# Altium schematic sheet keyboard.SchDoc
size A1
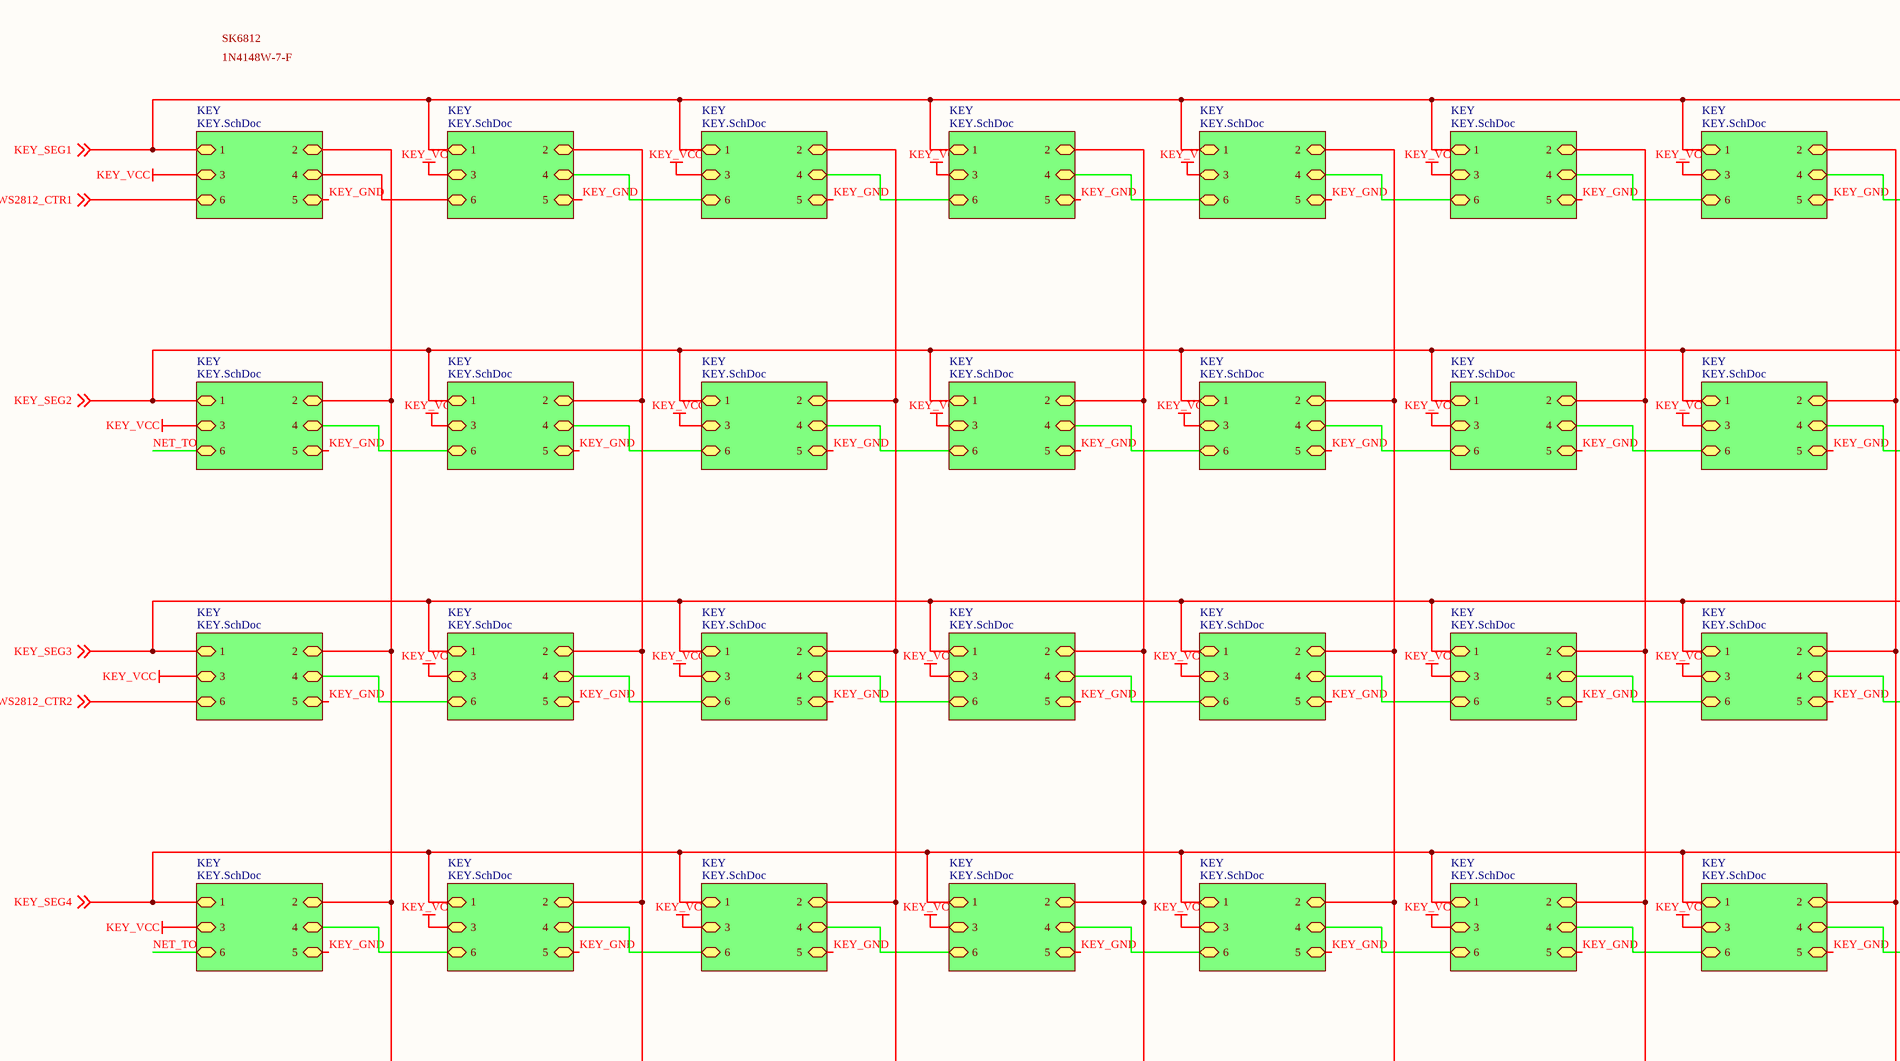
[diagram p0: keyboard.SchDoc, top left]
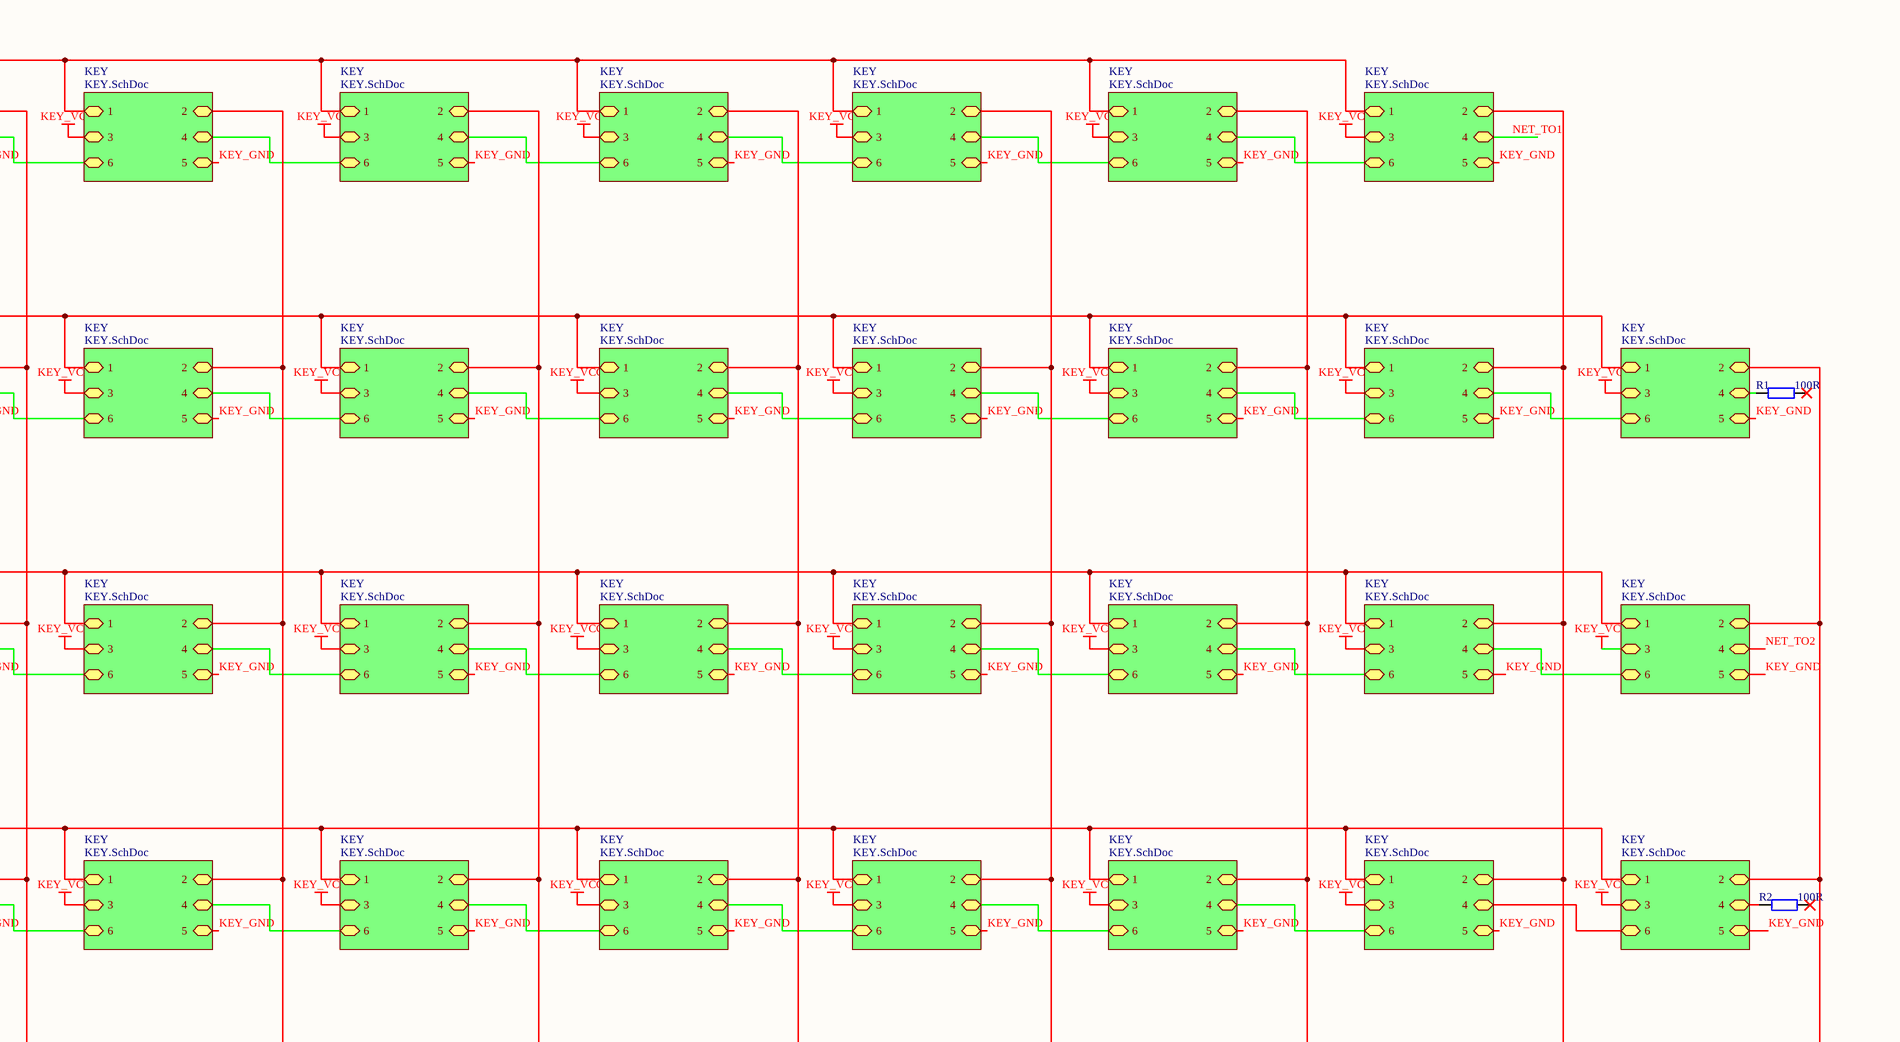
[diagram p1: keyboard.SchDoc, top right]
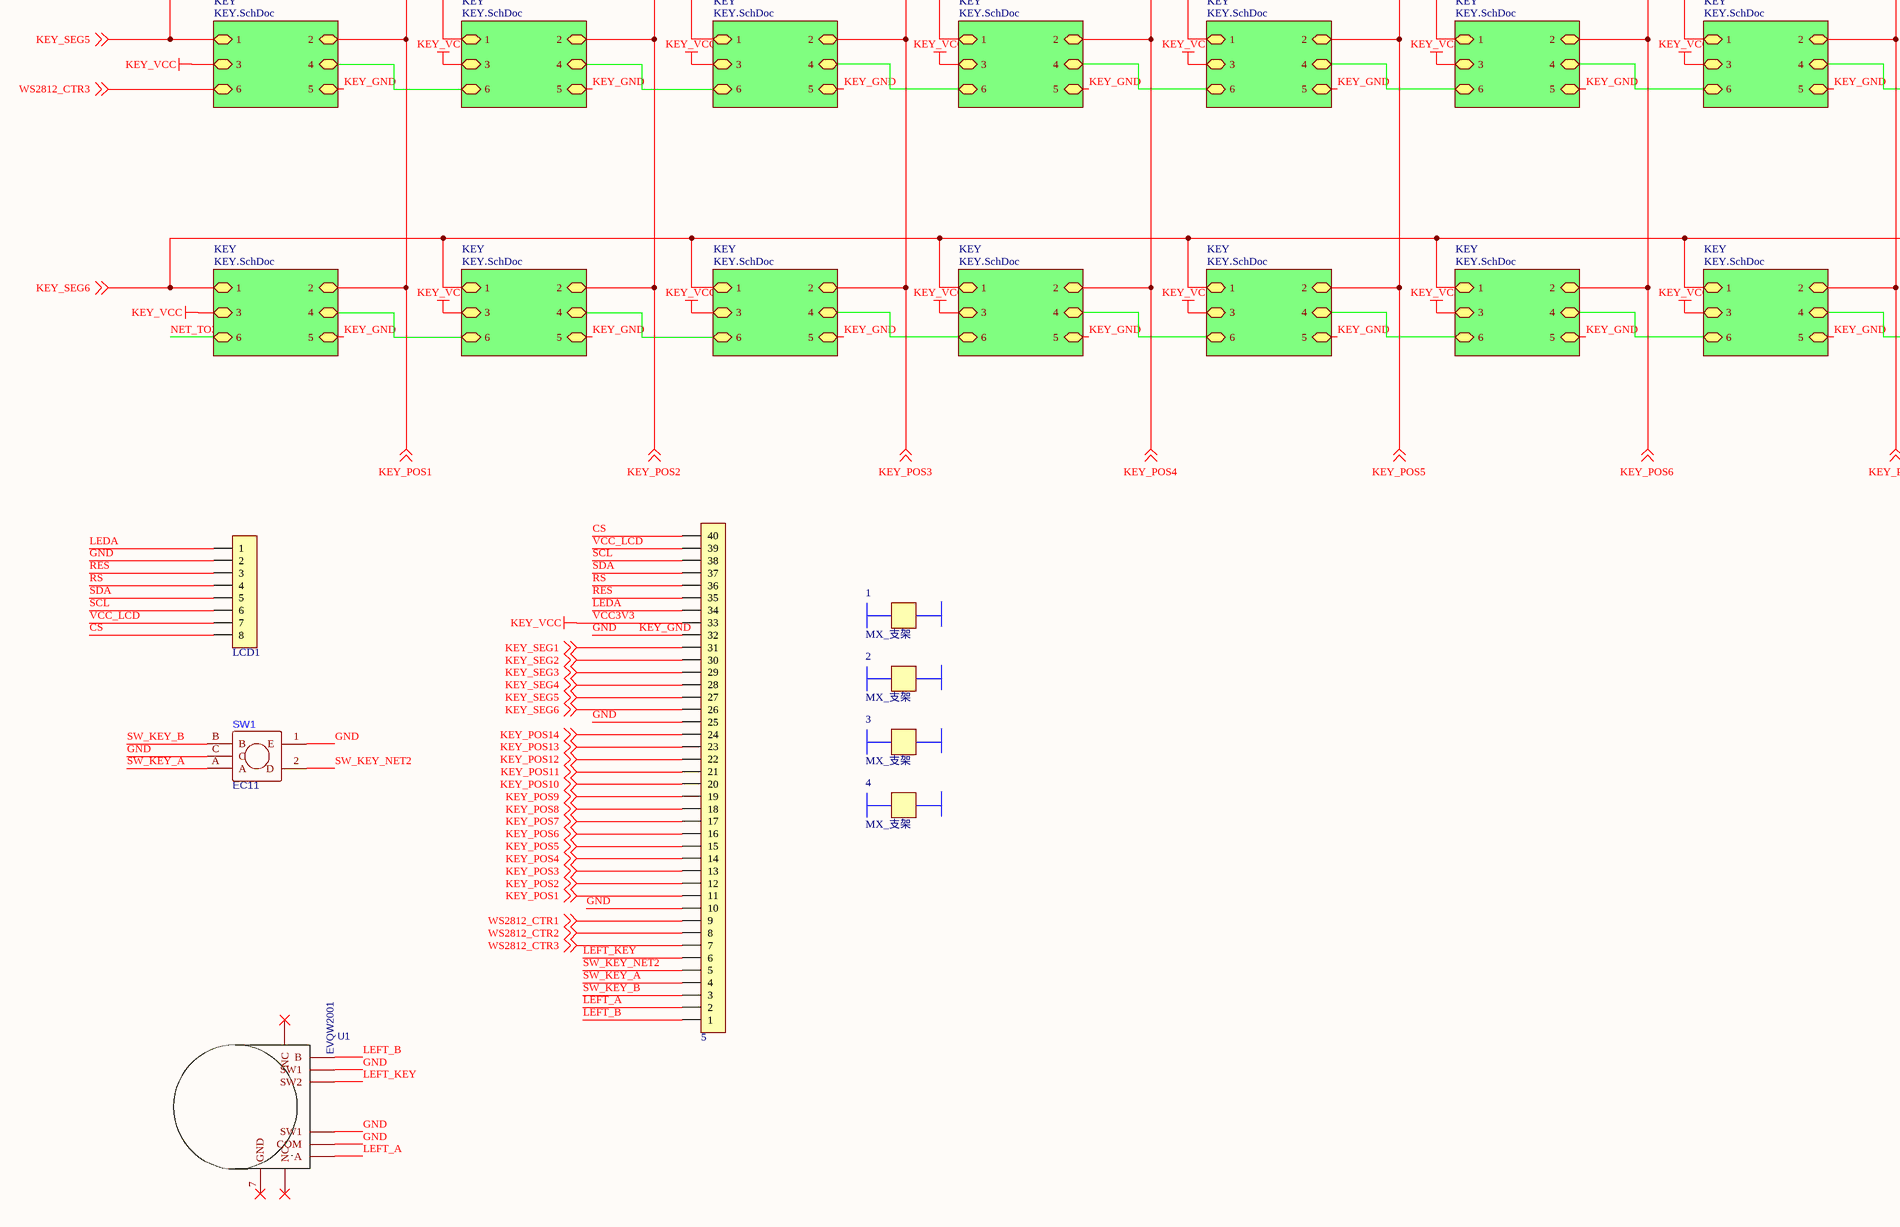
[diagram p2: keyboard.SchDoc, bottom left]
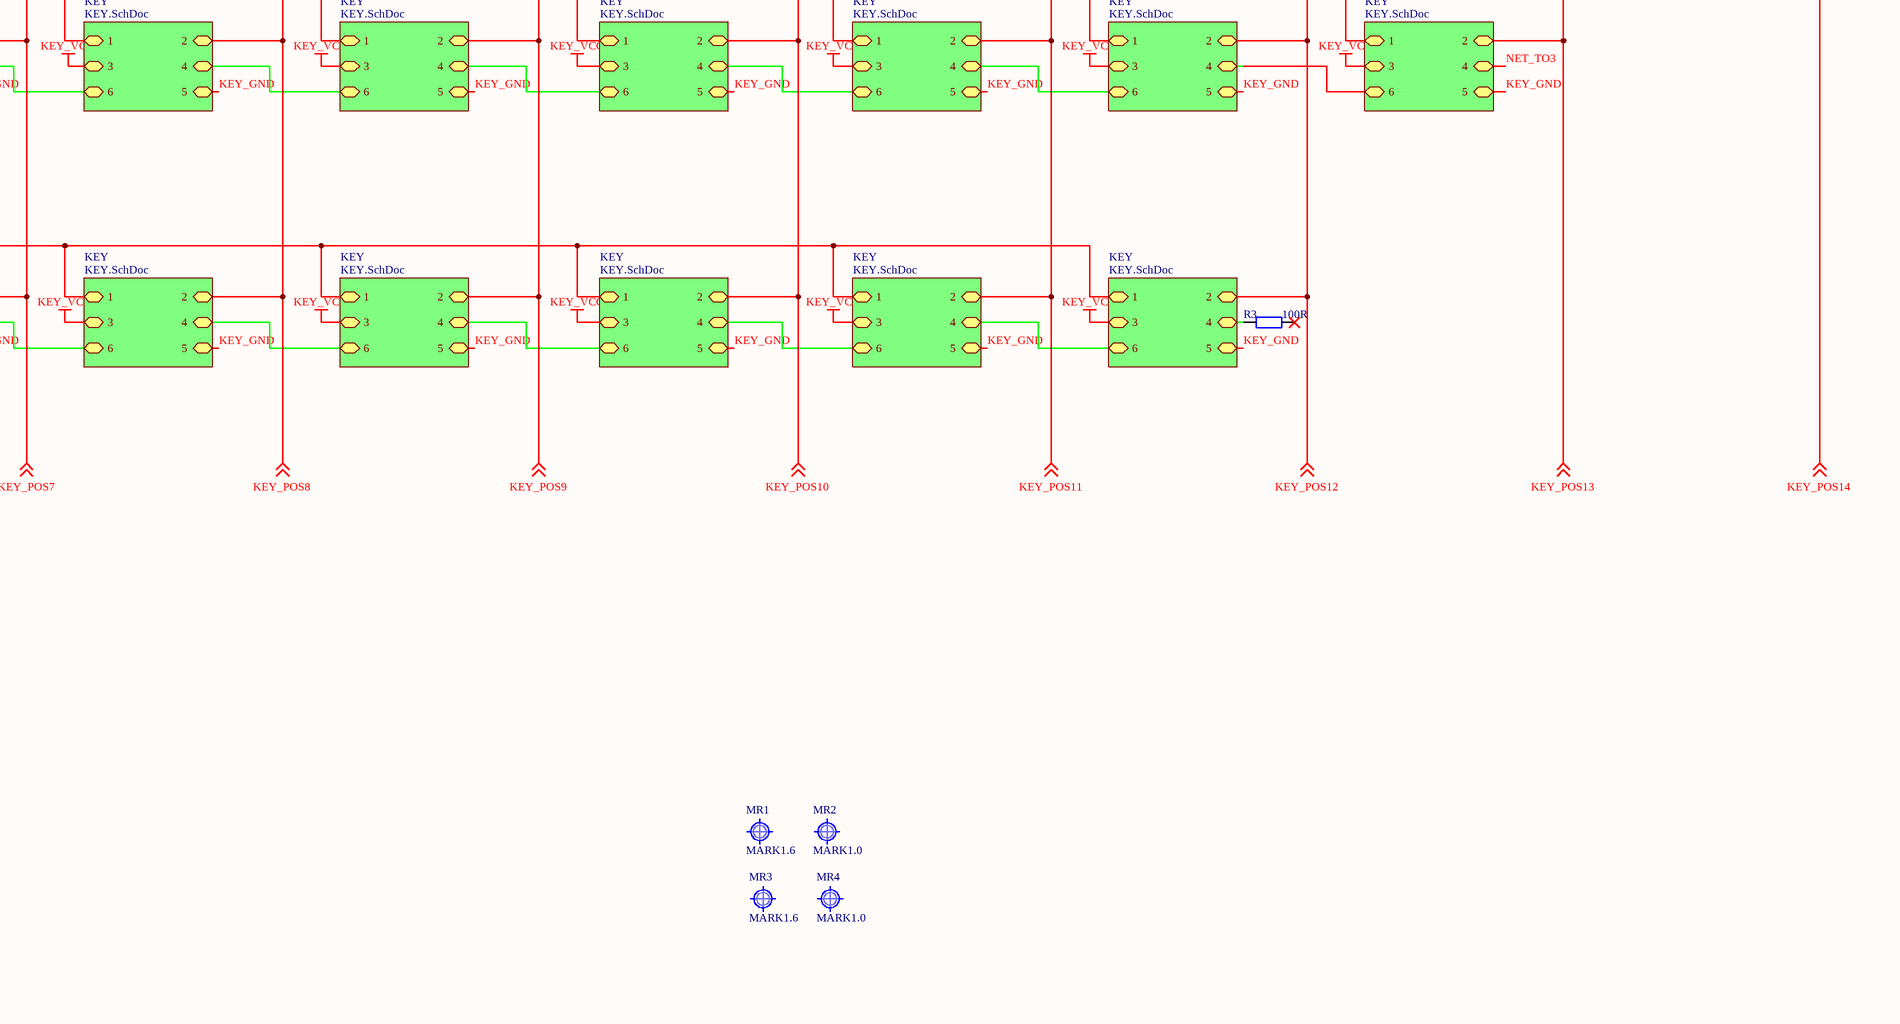
[diagram p3: keyboard.SchDoc, bottom right]

## Parts
1  MX_支架  [1x2]
2  MX_支架  [1x2]
3  MX_支架  [1x2]
4  MX_支架  [1x2]
5  FPC1.0-40P  [FPC0.5 2H-WS-40P]  (value not drawn)
LCD1  FPC1.0-8P  [FPC0.5 2H-WS-8P]  (value not drawn)
MR1  MARK1.6  [Mark 1.6]
MR2  MARK1.0  [Mark 1]
MR3  MARK1.6  [Mark 1.6]
MR4  MARK1.0  [Mark 1]
R1  100R  [R 0805_M]
R2  100R  [R 0805_M]
R3  100R  [R 0805_M]
SW1  EC11  [BOURNS_PEC11R-4XXXF-SXXXX]
U1  EVQW2001  [EVQWK2001 - duplicate]

## Sub-sheets
KEY = KEY.SchDoc: 2 (bidir), 3 (bidir), 5 (bidir), 4 (bidir), 6 (bidir), 1 (bidir)
KEY = KEY.SchDoc: 2 (bidir), 3 (bidir), 5 (bidir), 4 (bidir), 6 (bidir), 1 (bidir)
KEY = KEY.SchDoc: 2 (bidir), 3 (bidir), 5 (bidir), 4 (bidir), 6 (bidir), 1 (bidir)
KEY = KEY.SchDoc: 2 (bidir), 3 (bidir), 5 (bidir), 4 (bidir), 6 (bidir), 1 (bidir)
KEY = KEY.SchDoc: 2 (bidir), 3 (bidir), 5 (bidir), 4 (bidir), 6 (bidir), 1 (bidir)
KEY = KEY.SchDoc: 2 (bidir), 3 (bidir), 5 (bidir), 4 (bidir), 6 (bidir), 1 (bidir)
KEY = KEY.SchDoc: 2 (bidir), 3 (bidir), 5 (bidir), 4 (bidir), 6 (bidir), 1 (bidir)
KEY = KEY.SchDoc: 2 (bidir), 3 (bidir), 5 (bidir), 4 (bidir), 6 (bidir), 1 (bidir)
KEY = KEY.SchDoc: 2 (bidir), 3 (bidir), 5 (bidir), 4 (bidir), 6 (bidir), 1 (bidir)
KEY = KEY.SchDoc: 2 (bidir), 3 (bidir), 5 (bidir), 4 (bidir), 6 (bidir), 1 (bidir)
KEY = KEY.SchDoc: 2 (bidir), 3 (bidir), 5 (bidir), 4 (bidir), 6 (bidir), 1 (bidir)
KEY = KEY.SchDoc: 2 (bidir), 3 (bidir), 5 (bidir), 4 (bidir), 6 (bidir), 1 (bidir)
KEY = KEY.SchDoc: 2 (bidir), 3 (bidir), 5 (bidir), 4 (bidir), 6 (bidir), 1 (bidir)
KEY = KEY.SchDoc: 2 (bidir), 3 (bidir), 5 (bidir), 4 (bidir), 6 (bidir), 1 (bidir)
KEY = KEY.SchDoc: 2 (bidir), 3 (bidir), 5 (bidir), 4 (bidir), 6 (bidir), 1 (bidir)
KEY = KEY.SchDoc: 2 (bidir), 3 (bidir), 5 (bidir), 4 (bidir), 6 (bidir), 1 (bidir)
KEY = KEY.SchDoc: 2 (bidir), 3 (bidir), 5 (bidir), 4 (bidir), 6 (bidir), 1 (bidir)
KEY = KEY.SchDoc: 2 (bidir), 3 (bidir), 5 (bidir), 4 (bidir), 6 (bidir), 1 (bidir)
KEY = KEY.SchDoc: 2 (bidir), 3 (bidir), 5 (bidir), 4 (bidir), 6 (bidir), 1 (bidir)
KEY = KEY.SchDoc: 2 (bidir), 3 (bidir), 5 (bidir), 4 (bidir), 6 (bidir), 1 (bidir)
KEY = KEY.SchDoc: 2 (bidir), 3 (bidir), 5 (bidir), 4 (bidir), 6 (bidir), 1 (bidir)
KEY = KEY.SchDoc: 2 (bidir), 3 (bidir), 5 (bidir), 4 (bidir), 6 (bidir), 1 (bidir)
KEY = KEY.SchDoc: 2 (bidir), 3 (bidir), 5 (bidir), 4 (bidir), 6 (bidir), 1 (bidir)
KEY = KEY.SchDoc: 2 (bidir), 3 (bidir), 5 (bidir), 4 (bidir), 6 (bidir), 1 (bidir)
KEY = KEY.SchDoc: 2 (bidir), 3 (bidir), 5 (bidir), 4 (bidir), 6 (bidir), 1 (bidir)
KEY = KEY.SchDoc: 2 (bidir), 3 (bidir), 5 (bidir), 4 (bidir), 6 (bidir), 1 (bidir)
KEY = KEY.SchDoc: 2 (bidir), 3 (bidir), 5 (bidir), 4 (bidir), 6 (bidir), 1 (bidir)
KEY = KEY.SchDoc: 2 (bidir), 3 (bidir), 5 (bidir), 4 (bidir), 6 (bidir), 1 (bidir)
KEY = KEY.SchDoc: 2 (bidir), 3 (bidir), 5 (bidir), 4 (bidir), 6 (bidir), 1 (bidir)
KEY = KEY.SchDoc: 2 (bidir), 3 (bidir), 5 (bidir), 4 (bidir), 6 (bidir), 1 (bidir)
KEY = KEY.SchDoc: 2 (bidir), 3 (bidir), 5 (bidir), 4 (bidir), 6 (bidir), 1 (bidir)
KEY = KEY.SchDoc: 2 (bidir), 3 (bidir), 5 (bidir), 4 (bidir), 6 (bidir), 1 (bidir)
KEY = KEY.SchDoc: 2 (bidir), 3 (bidir), 5 (bidir), 4 (bidir), 6 (bidir), 1 (bidir)
KEY = KEY.SchDoc: 2 (bidir), 3 (bidir), 5 (bidir), 4 (bidir), 6 (bidir), 1 (bidir)
KEY = KEY.SchDoc: 2 (bidir), 3 (bidir), 5 (bidir), 4 (bidir), 6 (bidir), 1 (bidir)
KEY = KEY.SchDoc: 2 (bidir), 3 (bidir), 5 (bidir), 4 (bidir), 6 (bidir), 1 (bidir)
KEY = KEY.SchDoc: 2 (bidir), 3 (bidir), 5 (bidir), 4 (bidir), 6 (bidir), 1 (bidir)
KEY = KEY.SchDoc: 2 (bidir), 3 (bidir), 5 (bidir), 4 (bidir), 6 (bidir), 1 (bidir)
KEY = KEY.SchDoc: 2 (bidir), 3 (bidir), 5 (bidir), 4 (bidir), 6 (bidir), 1 (bidir)
KEY = KEY.SchDoc: 2 (bidir), 3 (bidir), 5 (bidir), 4 (bidir), 6 (bidir), 1 (bidir)
KEY = KEY.SchDoc: 2 (bidir), 3 (bidir), 5 (bidir), 4 (bidir), 6 (bidir), 1 (bidir)
KEY = KEY.SchDoc: 2 (bidir), 3 (bidir), 5 (bidir), 4 (bidir), 6 (bidir), 1 (bidir)
KEY = KEY.SchDoc: 2 (bidir), 3 (bidir), 5 (bidir), 4 (bidir), 6 (bidir), 1 (bidir)
KEY = KEY.SchDoc: 2 (bidir), 3 (bidir), 5 (bidir), 4 (bidir), 6 (bidir), 1 (bidir)
KEY = KEY.SchDoc: 2 (bidir), 3 (bidir), 5 (bidir), 4 (bidir), 6 (bidir), 1 (bidir)
KEY = KEY.SchDoc: 2 (bidir), 3 (bidir), 5 (bidir), 4 (bidir), 6 (bidir), 1 (bidir)
KEY = KEY.SchDoc: 2 (bidir), 3 (bidir), 5 (bidir), 4 (bidir), 6 (bidir), 1 (bidir)
KEY = KEY.SchDoc: 2 (bidir), 3 (bidir), 5 (bidir), 4 (bidir), 6 (bidir), 1 (bidir)
KEY = KEY.SchDoc: 2 (bidir), 3 (bidir), 5 (bidir), 4 (bidir), 6 (bidir), 1 (bidir)
KEY = KEY.SchDoc: 2 (bidir), 3 (bidir), 5 (bidir), 4 (bidir), 6 (bidir), 1 (bidir)
KEY = KEY.SchDoc: 2 (bidir), 3 (bidir), 5 (bidir), 4 (bidir), 6 (bidir), 1 (bidir)
KEY = KEY.SchDoc: 2 (bidir), 3 (bidir), 5 (bidir), 4 (bidir), 6 (bidir), 1 (bidir)
KEY = KEY.SchDoc: 2 (bidir), 3 (bidir), 5 (bidir), 4 (bidir), 6 (bidir), 1 (bidir)
KEY = KEY.SchDoc: 2 (bidir), 3 (bidir), 5 (bidir), 4 (bidir), 6 (bidir), 1 (bidir)
KEY = KEY.SchDoc: 2 (bidir), 3 (bidir), 5 (bidir), 4 (bidir), 6 (bidir), 1 (bidir)
KEY = KEY.SchDoc: 2 (bidir), 3 (bidir), 5 (bidir), 4 (bidir), 6 (bidir), 1 (bidir)
KEY = KEY.SchDoc: 2 (bidir), 3 (bidir), 5 (bidir), 4 (bidir), 6 (bidir), 1 (bidir)
KEY = KEY.SchDoc: 2 (bidir), 3 (bidir), 5 (bidir), 4 (bidir), 6 (bidir), 1 (bidir)
KEY = KEY.SchDoc: 2 (bidir), 3 (bidir), 5 (bidir), 4 (bidir), 6 (bidir), 1 (bidir)
KEY = KEY.SchDoc: 2 (bidir), 3 (bidir), 5 (bidir), 4 (bidir), 6 (bidir), 1 (bidir)
KEY = KEY.SchDoc: 2 (bidir), 3 (bidir), 5 (bidir), 4 (bidir), 6 (bidir), 1 (bidir)
KEY = KEY.SchDoc: 2 (bidir), 3 (bidir), 5 (bidir), 4 (bidir), 6 (bidir), 1 (bidir)
KEY = KEY.SchDoc: 2 (bidir), 3 (bidir), 5 (bidir), 4 (bidir), 6 (bidir), 1 (bidir)
KEY = KEY.SchDoc: 2 (bidir), 3 (bidir), 5 (bidir), 4 (bidir), 6 (bidir), 1 (bidir)
KEY = KEY.SchDoc: 2 (bidir), 3 (bidir), 5 (bidir), 4 (bidir), 6 (bidir), 1 (bidir)
KEY = KEY.SchDoc: 2 (bidir), 3 (bidir), 5 (bidir), 4 (bidir), 6 (bidir), 1 (bidir)
KEY = KEY.SchDoc: 2 (bidir), 3 (bidir), 5 (bidir), 4 (bidir), 6 (bidir), 1 (bidir)
KEY = KEY.SchDoc: 2 (bidir), 3 (bidir), 5 (bidir), 4 (bidir), 6 (bidir), 1 (bidir)
KEY = KEY.SchDoc: 2 (bidir), 3 (bidir), 5 (bidir), 4 (bidir), 6 (bidir), 1 (bidir)
KEY = KEY.SchDoc: 2 (bidir), 3 (bidir), 5 (bidir), 4 (bidir), 6 (bidir), 1 (bidir)
KEY = KEY.SchDoc: 2 (bidir), 3 (bidir), 5 (bidir), 4 (bidir), 6 (bidir), 1 (bidir)
KEY = KEY.SchDoc: 2 (bidir), 3 (bidir), 5 (bidir), 4 (bidir), 6 (bidir), 1 (bidir)
KEY = KEY.SchDoc: 2 (bidir), 3 (bidir), 5 (bidir), 4 (bidir), 6 (bidir), 1 (bidir)
KEY = KEY.SchDoc: 2 (bidir), 3 (bidir), 5 (bidir), 4 (bidir), 6 (bidir), 1 (bidir)
KEY = KEY.SchDoc: 2 (bidir), 3 (bidir), 5 (bidir), 4 (bidir), 6 (bidir), 1 (bidir)
KEY = KEY.SchDoc: 2 (bidir), 3 (bidir), 5 (bidir), 4 (bidir), 6 (bidir), 1 (bidir)
KEY = KEY.SchDoc: 2 (bidir), 3 (bidir), 5 (bidir), 4 (bidir), 6 (bidir), 1 (bidir)
KEY = KEY.SchDoc: 2 (bidir), 3 (bidir), 5 (bidir), 4 (bidir), 6 (bidir), 1 (bidir)
KEY = KEY.SchDoc: 2 (bidir), 3 (bidir), 5 (bidir), 4 (bidir), 6 (bidir), 1 (bidir)
KEY = KEY.SchDoc: 2 (bidir), 3 (bidir), 5 (bidir), 4 (bidir), 6 (bidir), 1 (bidir)

## Nets
VCC3V3: 5.33 ; sheet KEY/3, sheet KEY/3, sheet KEY/3, sheet KEY/3, sheet KEY/3, sheet KEY/3, sheet KEY/3, sheet KEY/3, sheet KEY/3, sheet KEY/3, sheet KEY/3, sheet KEY/3, sheet KEY/3, sheet KEY/3, sheet KEY/3, sheet KEY/3, sheet KEY/3, sheet KEY/3, sheet KEY/3, sheet KEY/3, sheet KEY/3, sheet KEY/3, sheet KEY/3, sheet KEY/3, sheet KEY/3, sheet KEY/3, sheet KEY/3, sheet KEY/3, sheet KEY/3, sheet KEY/3, sheet KEY/3, sheet KEY/3, sheet KEY/3, sheet KEY/3, sheet KEY/3, sheet KEY/3, sheet KEY/3, sheet KEY/3, sheet KEY/3, sheet KEY/3, sheet KEY/3, sheet KEY/3, sheet KEY/3, sheet KEY/3, sheet KEY/3, sheet KEY/3, sheet KEY/3, sheet KEY/3, sheet KEY/3, sheet KEY/3, sheet KEY/3, sheet KEY/3, sheet KEY/3, sheet KEY/3, sheet KEY/3, sheet KEY/3, sheet KEY/3, sheet KEY/3, sheet KEY/3, sheet KEY/3, sheet KEY/3, sheet KEY/3, sheet KEY/3, sheet KEY/3, sheet KEY/3, sheet KEY/3, sheet KEY/3, sheet KEY/3, sheet KEY/3, sheet KEY/3, sheet KEY/3, sheet KEY/3, sheet KEY/3, sheet KEY/3, sheet KEY/3, sheet KEY/3, sheet KEY/3, sheet KEY/3, sheet KEY/3, sheet KEY/3  [also labelled KEY_VCC]
CS: 5.40 LCD1.8
GND: 5.10 5.25 5.32 LCD1.2 SW1.1(E) SW1.C U1.2(SW1) U1.4(SW1) U1.5(COM) ; sheet KEY/5, sheet KEY/5, sheet KEY/5, sheet KEY/5, sheet KEY/5, sheet KEY/5, sheet KEY/5, sheet KEY/5, sheet KEY/5, sheet KEY/5, sheet KEY/5, sheet KEY/5, sheet KEY/5, sheet KEY/5, sheet KEY/5, sheet KEY/5, sheet KEY/5, sheet KEY/5, sheet KEY/5, sheet KEY/5, sheet KEY/5, sheet KEY/5, sheet KEY/5, sheet KEY/5, sheet KEY/5, sheet KEY/5, sheet KEY/5, sheet KEY/5, sheet KEY/5, sheet KEY/5, sheet KEY/5, sheet KEY/5, sheet KEY/5, sheet KEY/5, sheet KEY/5, sheet KEY/5, sheet KEY/5, sheet KEY/5, sheet KEY/5, sheet KEY/5, sheet KEY/5, sheet KEY/5, sheet KEY/5, sheet KEY/5, sheet KEY/5, sheet KEY/5, sheet KEY/5, sheet KEY/5, sheet KEY/5, sheet KEY/5, sheet KEY/5, sheet KEY/5, sheet KEY/5, sheet KEY/5, sheet KEY/5, sheet KEY/5, sheet KEY/5, sheet KEY/5, sheet KEY/5, sheet KEY/5, sheet KEY/5, sheet KEY/5, sheet KEY/5, sheet KEY/5, sheet KEY/5, sheet KEY/5, sheet KEY/5, sheet KEY/5, sheet KEY/5, sheet KEY/5, sheet KEY/5, sheet KEY/5, sheet KEY/5, sheet KEY/5, sheet KEY/5, sheet KEY/5, sheet KEY/5, sheet KEY/5, sheet KEY/5, sheet KEY/5  [also labelled KEY_GND]
KEY_POS1: 5.11 ; off-sheet KEY_POS1, sheet KEY/2, sheet KEY/2, sheet KEY/2, sheet KEY/2, sheet KEY/2, sheet KEY/2
KEY_POS2: 5.12 ; off-sheet KEY_POS2, sheet KEY/2, sheet KEY/2, sheet KEY/2, sheet KEY/2, sheet KEY/2, sheet KEY/2
KEY_POS3: 5.13 ; off-sheet KEY_POS3, sheet KEY/2, sheet KEY/2, sheet KEY/2, sheet KEY/2, sheet KEY/2, sheet KEY/2
KEY_POS4: 5.14 ; off-sheet KEY_POS4, sheet KEY/2, sheet KEY/2, sheet KEY/2, sheet KEY/2, sheet KEY/2, sheet KEY/2
KEY_POS5: 5.15 ; off-sheet KEY_POS5, sheet KEY/2, sheet KEY/2, sheet KEY/2, sheet KEY/2, sheet KEY/2, sheet KEY/2
KEY_POS6: 5.16 ; off-sheet KEY_POS6, sheet KEY/2, sheet KEY/2, sheet KEY/2, sheet KEY/2, sheet KEY/2, sheet KEY/2
KEY_POS7: 5.17 ; off-sheet KEY_POS7, sheet KEY/2, sheet KEY/2, sheet KEY/2, sheet KEY/2, sheet KEY/2, sheet KEY/2
KEY_POS8: 5.18 ; off-sheet KEY_POS8, sheet KEY/2, sheet KEY/2, sheet KEY/2, sheet KEY/2, sheet KEY/2, sheet KEY/2
KEY_POS9: 5.19 ; off-sheet KEY_POS9, sheet KEY/2, sheet KEY/2, sheet KEY/2, sheet KEY/2, sheet KEY/2, sheet KEY/2
KEY_POS10: 5.20 ; off-sheet KEY_POS10, sheet KEY/2, sheet KEY/2, sheet KEY/2, sheet KEY/2, sheet KEY/2, sheet KEY/2
KEY_POS11: 5.21 ; off-sheet KEY_POS11, sheet KEY/2, sheet KEY/2, sheet KEY/2, sheet KEY/2, sheet KEY/2, sheet KEY/2
KEY_POS12: 5.22 ; off-sheet KEY_POS12, sheet KEY/2, sheet KEY/2, sheet KEY/2, sheet KEY/2, sheet KEY/2, sheet KEY/2
KEY_POS13: 5.23 ; off-sheet KEY_POS13, sheet KEY/2, sheet KEY/2, sheet KEY/2, sheet KEY/2, sheet KEY/2
KEY_POS14: 5.24 ; off-sheet KEY_POS14, sheet KEY/2, sheet KEY/2, sheet KEY/2
KEY_SEG1: 5.31 ; off-sheet KEY_SEG1, sheet KEY/1, sheet KEY/1, sheet KEY/1, sheet KEY/1, sheet KEY/1, sheet KEY/1, sheet KEY/1, sheet KEY/1, sheet KEY/1, sheet KEY/1, sheet KEY/1, sheet KEY/1, sheet KEY/1
KEY_SEG2: 5.30 ; off-sheet KEY_SEG2, sheet KEY/1, sheet KEY/1, sheet KEY/1, sheet KEY/1, sheet KEY/1, sheet KEY/1, sheet KEY/1, sheet KEY/1, sheet KEY/1, sheet KEY/1, sheet KEY/1, sheet KEY/1, sheet KEY/1, sheet KEY/1
KEY_SEG3: 5.29 ; off-sheet KEY_SEG3, sheet KEY/1, sheet KEY/1, sheet KEY/1, sheet KEY/1, sheet KEY/1, sheet KEY/1, sheet KEY/1, sheet KEY/1, sheet KEY/1, sheet KEY/1, sheet KEY/1, sheet KEY/1, sheet KEY/1, sheet KEY/1
KEY_SEG4: 5.28 ; off-sheet KEY_SEG4, sheet KEY/1, sheet KEY/1, sheet KEY/1, sheet KEY/1, sheet KEY/1, sheet KEY/1, sheet KEY/1, sheet KEY/1, sheet KEY/1, sheet KEY/1, sheet KEY/1, sheet KEY/1, sheet KEY/1, sheet KEY/1
KEY_SEG5: 5.27 ; off-sheet KEY_SEG5, sheet KEY/1, sheet KEY/1, sheet KEY/1, sheet KEY/1, sheet KEY/1, sheet KEY/1, sheet KEY/1, sheet KEY/1, sheet KEY/1, sheet KEY/1, sheet KEY/1, sheet KEY/1, sheet KEY/1
KEY_SEG6: 5.26 ; off-sheet KEY_SEG6, sheet KEY/1, sheet KEY/1, sheet KEY/1, sheet KEY/1, sheet KEY/1, sheet KEY/1, sheet KEY/1, sheet KEY/1, sheet KEY/1, sheet KEY/1, sheet KEY/1, sheet KEY/1
LEDA: 5.34 LCD1.1
LEFT_A: 5.2 U1.6(A)
LEFT_B: 5.1 U1.1(B)
LEFT_KEY: 5.6 U1.3(SW2)
NET_TO1: sheet KEY/4, sheet KEY/6
NET_TO2: sheet KEY/4, sheet KEY/6
NET_TO3: sheet KEY/4, sheet KEY/6
RES: 5.35 LCD1.3
RS: 5.36 LCD1.4
SCL: 5.38 LCD1.6
SDA: 5.37 LCD1.5
SW_KEY_A: 5.4 SW1.A
SW_KEY_B: 5.3 SW1.B
SW_KEY_NET2: 5.5 SW1.2(D)
VCC_LCD: 5.39 LCD1.7
WS2812_CTR1: 5.9 ; off-sheet WS2812_CTR1, sheet KEY/6
WS2812_CTR2: 5.8 ; off-sheet WS2812_CTR2, sheet KEY/6
WS2812_CTR3: 5.7 ; off-sheet WS2812_CTR3, sheet KEY/6
NetR1_1: R1.1 ; sheet KEY/4
NetR2_1: R2.1 ; sheet KEY/4
NetR3_1: R3.1 ; sheet KEY/4
(unnamed): sheet KEY/4, sheet KEY/6
(unnamed): sheet KEY/6, sheet KEY/4
(unnamed): sheet KEY/4, sheet KEY/6
(unnamed): sheet KEY/4, sheet KEY/6
(unnamed): sheet KEY/4, sheet KEY/6
(unnamed): sheet KEY/4, sheet KEY/6
(unnamed): sheet KEY/4, sheet KEY/6
(unnamed): sheet KEY/4, sheet KEY/6
(unnamed): sheet KEY/4, sheet KEY/6
(unnamed): sheet KEY/4, sheet KEY/6
(unnamed): sheet KEY/4, sheet KEY/6
(unnamed): sheet KEY/4, sheet KEY/6
(unnamed): sheet KEY/4, sheet KEY/6
(unnamed): sheet KEY/4, sheet KEY/6
(unnamed): sheet KEY/4, sheet KEY/6
(unnamed): sheet KEY/4, sheet KEY/6
(unnamed): sheet KEY/4, sheet KEY/6
(unnamed): sheet KEY/4, sheet KEY/6
(unnamed): sheet KEY/4, sheet KEY/6
(unnamed): sheet KEY/4, sheet KEY/6
(unnamed): sheet KEY/4, sheet KEY/6
(unnamed): sheet KEY/4, sheet KEY/6
(unnamed): sheet KEY/4, sheet KEY/6
(unnamed): sheet KEY/4, sheet KEY/6
(unnamed): sheet KEY/4, sheet KEY/6
(unnamed): sheet KEY/4, sheet KEY/6
(unnamed): sheet KEY/4, sheet KEY/6
(unnamed): sheet KEY/4, sheet KEY/6
(unnamed): sheet KEY/4, sheet KEY/6
(unnamed): sheet KEY/4, sheet KEY/6
(unnamed): sheet KEY/4, sheet KEY/6
(unnamed): sheet KEY/4, sheet KEY/6
(unnamed): sheet KEY/4, sheet KEY/6
(unnamed): sheet KEY/4, sheet KEY/6
(unnamed): sheet KEY/4, sheet KEY/6
(unnamed): sheet KEY/4, sheet KEY/6
(unnamed): sheet KEY/4, sheet KEY/6
(unnamed): sheet KEY/4, sheet KEY/6
(unnamed): sheet KEY/4, sheet KEY/6
(unnamed): sheet KEY/4, sheet KEY/6
(unnamed): sheet KEY/4, sheet KEY/6
(unnamed): sheet KEY/4, sheet KEY/6
(unnamed): sheet KEY/4, sheet KEY/6
(unnamed): sheet KEY/4, sheet KEY/6
(unnamed): sheet KEY/4, sheet KEY/6
(unnamed): sheet KEY/4, sheet KEY/6
(unnamed): sheet KEY/4, sheet KEY/6
(unnamed): sheet KEY/4, sheet KEY/6
(unnamed): sheet KEY/4, sheet KEY/6
(unnamed): sheet KEY/4, sheet KEY/6
(unnamed): sheet KEY/4, sheet KEY/6
(unnamed): sheet KEY/4, sheet KEY/6
(unnamed): sheet KEY/4, sheet KEY/6
(unnamed): sheet KEY/4, sheet KEY/6
(unnamed): sheet KEY/4, sheet KEY/6
(unnamed): sheet KEY/4, sheet KEY/6
(unnamed): sheet KEY/4, sheet KEY/6
(unnamed): sheet KEY/4, sheet KEY/6
(unnamed): sheet KEY/4, sheet KEY/6
(unnamed): sheet KEY/4, sheet KEY/6
(unnamed): sheet KEY/4, sheet KEY/6
(unnamed): sheet KEY/4, sheet KEY/6
(unnamed): sheet KEY/4, sheet KEY/6
(unnamed): sheet KEY/4, sheet KEY/6
(unnamed): sheet KEY/4, sheet KEY/6
(unnamed): sheet KEY/4, sheet KEY/6
(unnamed): sheet KEY/4, sheet KEY/6
(unnamed): sheet KEY/4, sheet KEY/6
(unnamed): sheet KEY/4, sheet KEY/6
(unnamed): sheet KEY/4, sheet KEY/6
(unnamed): sheet KEY/4, sheet KEY/6
(unnamed): sheet KEY/4, sheet KEY/6
(unnamed): sheet KEY/4, sheet KEY/6
(unnamed): sheet KEY/4, sheet KEY/6

Not connected (* = marked no-connect by the designer): R1 2*; R2 2*; R3 2*; U1 7(GND)* 8(NC)*

## Notes on the sheet
- SK6812
- 1N4148W-7-F
- Title
- Size:
- Date:
- File:
- A1
- Number:
- Time:
- Revision:
- Sheet
- of

## Library data of the parts
5 = FPC-40P: FPC连接器; 版权归属: 黎明电子style; BOM名称: FPC连接器; 学习资源: https://lmdzstyle.taobao.com/
LCD1 = FPC-8P: FPC连接器; 版权归属: 黎明电子style; BOM名称: FPC连接器; 学习资源: https://lmdzstyle.taobao.com/
MR1-MR4 = MARK: 光学定位点
R1-R3 = R: 贴片电阻
U1 = EVQW2001: Contributor: jam_dan; spicePre: U; spiceSymbolName: EVQW2001